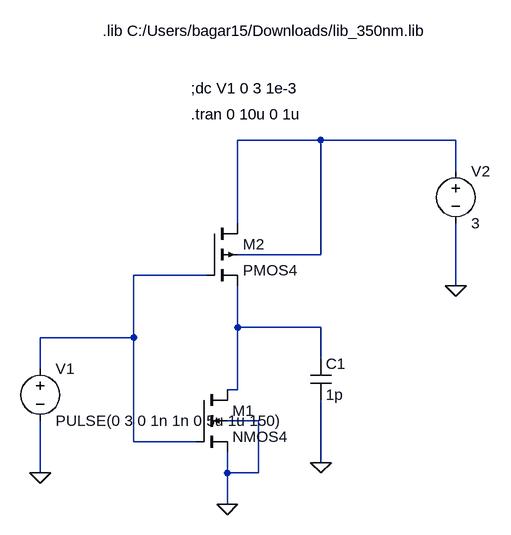
[diagram p0: schematic obvod1.asc]
obvod1.asc, the LTspice schematic file:
Version 4
SHEET 1 880 680
WIRE 32 -208 -96 -208
WIRE 240 -208 32 -208
WIRE 240 -160 240 -208
WIRE -96 -80 -96 -208
WIRE 32 -32 32 -208
WIRE 32 -32 -96 -32
WIRE -144 0 -256 0
WIRE 240 16 240 -80
WIRE -96 80 -96 16
WIRE 32 80 -96 80
WIRE -256 96 -256 0
WIRE -256 96 -400 96
WIRE 32 128 32 80
WIRE -400 144 -400 96
WIRE -96 176 -96 80
WIRE -96 176 -112 176
WIRE -64 224 -112 224
WIRE -256 256 -256 96
WIRE -160 256 -256 256
WIRE 32 288 32 192
WIRE -400 304 -400 224
WIRE -112 304 -112 272
WIRE -64 304 -64 224
WIRE -64 304 -112 304
WIRE -112 352 -112 304
FLAG -400 304 0
FLAG -112 352 0
FLAG 240 16 0
FLAG 32 288 0
SYMBOL nmos4 -160 176 R0
SYMATTR InstName M1
SYMATTR Value NMOS4
SYMATTR Value2 l=2u w=13.5u
SYMBOL pmos4 -144 -80 R0
SYMATTR InstName M2
SYMATTR Value PMOS4
SYMATTR Value2 l=2u w=50u
SYMBOL voltage -400 128 R0
WINDOW 123 0 0 Left 2
WINDOW 39 0 0 Left 2
SYMATTR InstName V1
SYMATTR Value PULSE(0 3 0 1n 1n 0.5u 1u 150)
SYMBOL voltage 240 -176 R0
WINDOW 123 0 0 Left 2
WINDOW 39 0 0 Left 2
SYMATTR InstName V2
SYMATTR Value 3
SYMBOL cap 16 128 R0
SYMATTR InstName C1
SYMATTR Value 1p
TEXT -168 -288 Left 2 !;dc V1 0 3 1e-3
TEXT -304 -376 Left 2 !.lib C:/Users/bagar15/Downloads/lib_350nm.lib
TEXT -168 -248 Left 2 !.tran 0 10u 0 1u

The netlist it stands for:
* obvod1.asc
M1 N003 N002 0 0 NMOS4 l=2u w=13.5u
M2 N001 N002 N003 N001 PMOS4 l=2u w=50u
V1 N002 0 PULSE(0 3 0 1n 1n 0.5u 1u 150)
V2 N001 0 3
C1 N003 0 1p
.model NMOS NMOS
.model PMOS PMOS
.lib standard.mos
;dc V1 0 3 1e-3
.lib C:/Users/bagar15/Downloads/lib_350nm.lib
.tran 0 10u 0 1u
.backanno
.end